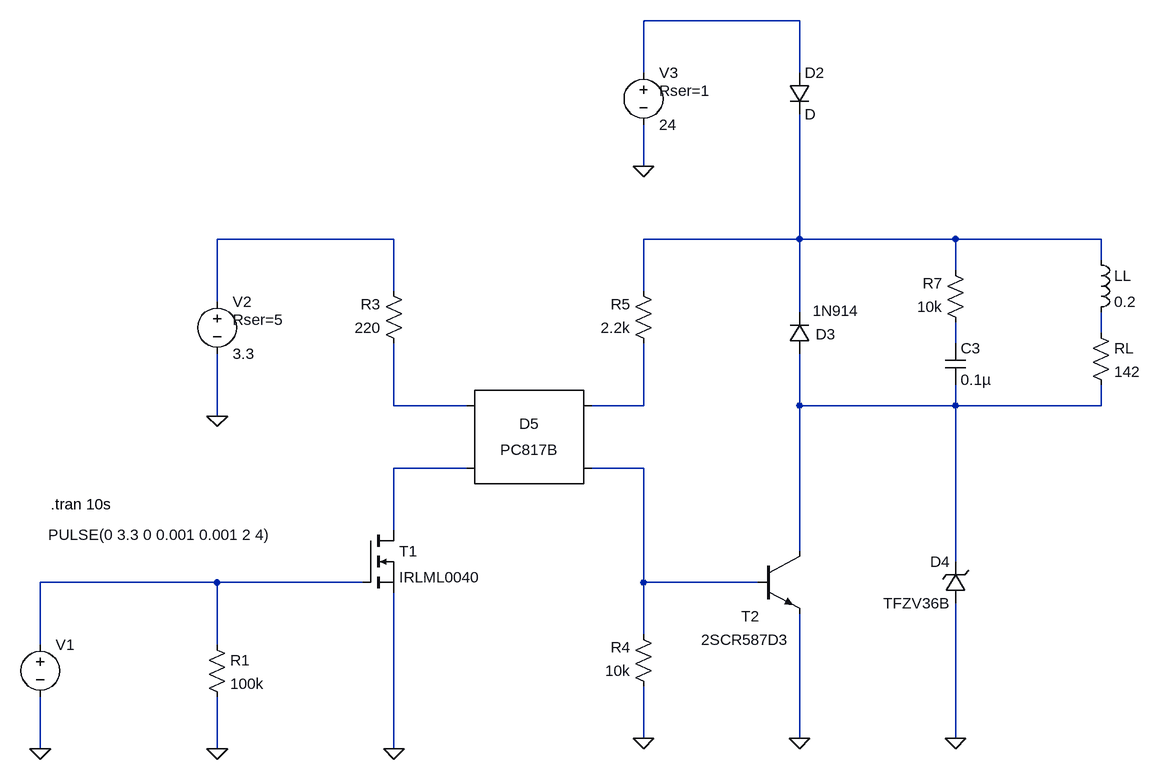
[diagram p0: schematic InductiveLoadSwitch_v3.asc]
InductiveLoadSwitch_v3.asc, the LTspice schematic file:
Version 4
SHEET 1 2724 884
WIRE 2096 -736 1856 -736
WIRE 1856 -656 1856 -736
WIRE 2096 -656 2096 -736
WIRE 1856 -512 1856 -576
WIRE 1472 -400 1200 -400
WIRE 2096 -400 2096 -592
WIRE 2096 -400 1856 -400
WIRE 2336 -400 2096 -400
WIRE 2560 -400 2336 -400
WIRE 2560 -368 2560 -400
WIRE 2336 -352 2336 -400
WIRE 1472 -320 1472 -400
WIRE 1856 -320 1856 -400
WIRE 1200 -304 1200 -400
WIRE 2096 -288 2096 -400
WIRE 2560 -256 2560 -288
WIRE 2336 -240 2336 -272
WIRE 1472 -144 1472 -240
WIRE 1584 -144 1472 -144
WIRE 1856 -144 1856 -240
WIRE 1856 -144 1776 -144
WIRE 2096 -144 2096 -224
WIRE 2336 -144 2336 -176
WIRE 2336 -144 2096 -144
WIRE 2560 -144 2560 -176
WIRE 2560 -144 2336 -144
WIRE 1200 -128 1200 -224
WIRE 1584 -48 1472 -48
WIRE 1856 -48 1776 -48
WIRE 1472 48 1472 -48
WIRE 2096 80 2096 -144
WIRE 2336 96 2336 -144
WIRE 1200 128 928 128
WIRE 1424 128 1200 128
WIRE 1856 128 1856 -48
WIRE 2032 128 1856 128
WIRE 1856 208 1856 128
WIRE 928 224 928 128
WIRE 1200 224 1200 128
WIRE 1856 368 1856 288
WIRE 2096 368 2096 176
WIRE 2336 368 2336 160
WIRE 928 384 928 304
WIRE 1200 384 1200 304
WIRE 1472 384 1472 144
FLAG 928 384 0
FLAG 1856 -512 0
FLAG 2336 368 0
FLAG 1200 -128 0
FLAG 1856 368 0
FLAG 1472 384 0
FLAG 1200 384 0
FLAG 2096 368 0
SYMBOL npn 2032 80 R0
WINDOW 0 -26 100 Left 2
WINDOW 3 -87 136 Left 2
SYMATTR InstName T2
SYMATTR Value 2SCR587D3
SYMBOL diode 2112 -224 R180
WINDOW 0 -40 30 Left 2
WINDOW 3 -76 66 Left 2
SYMATTR InstName D3
SYMATTR Value 1N914
SYMBOL ind 2544 -384 R0
SYMATTR InstName LL
SYMATTR Value 0.2
SYMBOL res 2544 -272 R0
SYMATTR InstName RL
SYMATTR Value 142
SYMBOL voltage 928 208 R0
WINDOW 3 12 -153 Left 2
WINDOW 123 0 0 Left 0
WINDOW 39 0 0 Left 0
SYMATTR Value PULSE(0 3.3 0 0.001 0.001 2 4)
SYMATTR InstName V1
SYMBOL voltage 1856 -672 R0
WINDOW 123 0 0 Left 0
WINDOW 39 24 44 Left 2
SYMATTR SpiceLine Rser=1
SYMATTR InstName V3
SYMATTR Value 24
SYMBOL zener 2352 160 R180
WINDOW 0 24 64 Left 2
WINDOW 3 24 0 Left 2
SYMATTR InstName D4
SYMATTR Value TFZV36B
SYMBOL voltage 1200 -320 R0
WINDOW 123 0 0 Left 0
WINDOW 39 24 44 Left 2
SYMATTR SpiceLine Rser=5
SYMATTR InstName V2
SYMATTR Value 3.3
SYMBOL res 2352 -256 R180
WINDOW 0 36 76 Left 2
WINDOW 3 36 40 Left 2
SYMATTR InstName R7
SYMATTR Value 10k
SYMBOL cap 2320 -240 R0
SYMATTR InstName C3
SYMATTR Value 0.1µ
SYMBOL Optos\\PC817B 1680 -96 R0
SYMATTR InstName D5
SYMBOL res 1872 304 R180
WINDOW 0 36 76 Left 2
WINDOW 3 36 40 Left 2
SYMATTR InstName R4
SYMATTR Value 10k
SYMBOL res 1872 -224 R180
WINDOW 0 36 76 Left 2
WINDOW 3 36 40 Left 2
SYMATTR InstName R5
SYMATTR Value 2.2k
SYMBOL nmos 1424 48 R0
SYMATTR InstName T1
SYMATTR Value IRLML0040
SYMBOL res 1184 208 R0
SYMATTR InstName R1
SYMATTR Value 100k
SYMBOL diode 2080 -656 R0
SYMATTR InstName D2
SYMBOL res 1488 -224 R180
WINDOW 0 36 76 Left 2
WINDOW 3 36 40 Left 2
SYMATTR InstName R3
SYMATTR Value 220
TEXT 944 8 Left 2 !.tran 10s

The netlist it stands for:
* InductiveLoadSwitch_v3.asc
Q§T2 N008 N010 0 0 2SCR587D3
D3 N008 N003 1N914
LL N003 N004 0.2
RL N004 N008 142
V1 N011 0 PULSE(0 3.3 0 0.001 0.001 2 4)
V3 N001 0 24 Rser=1
D4 0 N008 TFZV36B
V2 N002 0 3.3 Rser=5
R7 N005 N003 10k
C3 N005 N008 0.1µ
XD5 N006 N009 N007 N010 PC817 Igain=1.5m
R4 0 N010 10k
R5 N007 N003 2.2k
M§T1 N009 N011 0 0 IRLML0040
R1 N011 0 100k
D2 N001 N003 D
R3 N006 N002 220
.model D D
.lib standard.dio
.model NPN NPN
.model PNP PNP
.lib standard.bjt
.model NMOS NMOS
.model PMOS PMOS
.lib standard.mos
.tran 10s
.lib PC817.sub
.backanno
.end